# EAGLE design riffle-beta-0.1.5 (EAGLE 7.5.0)
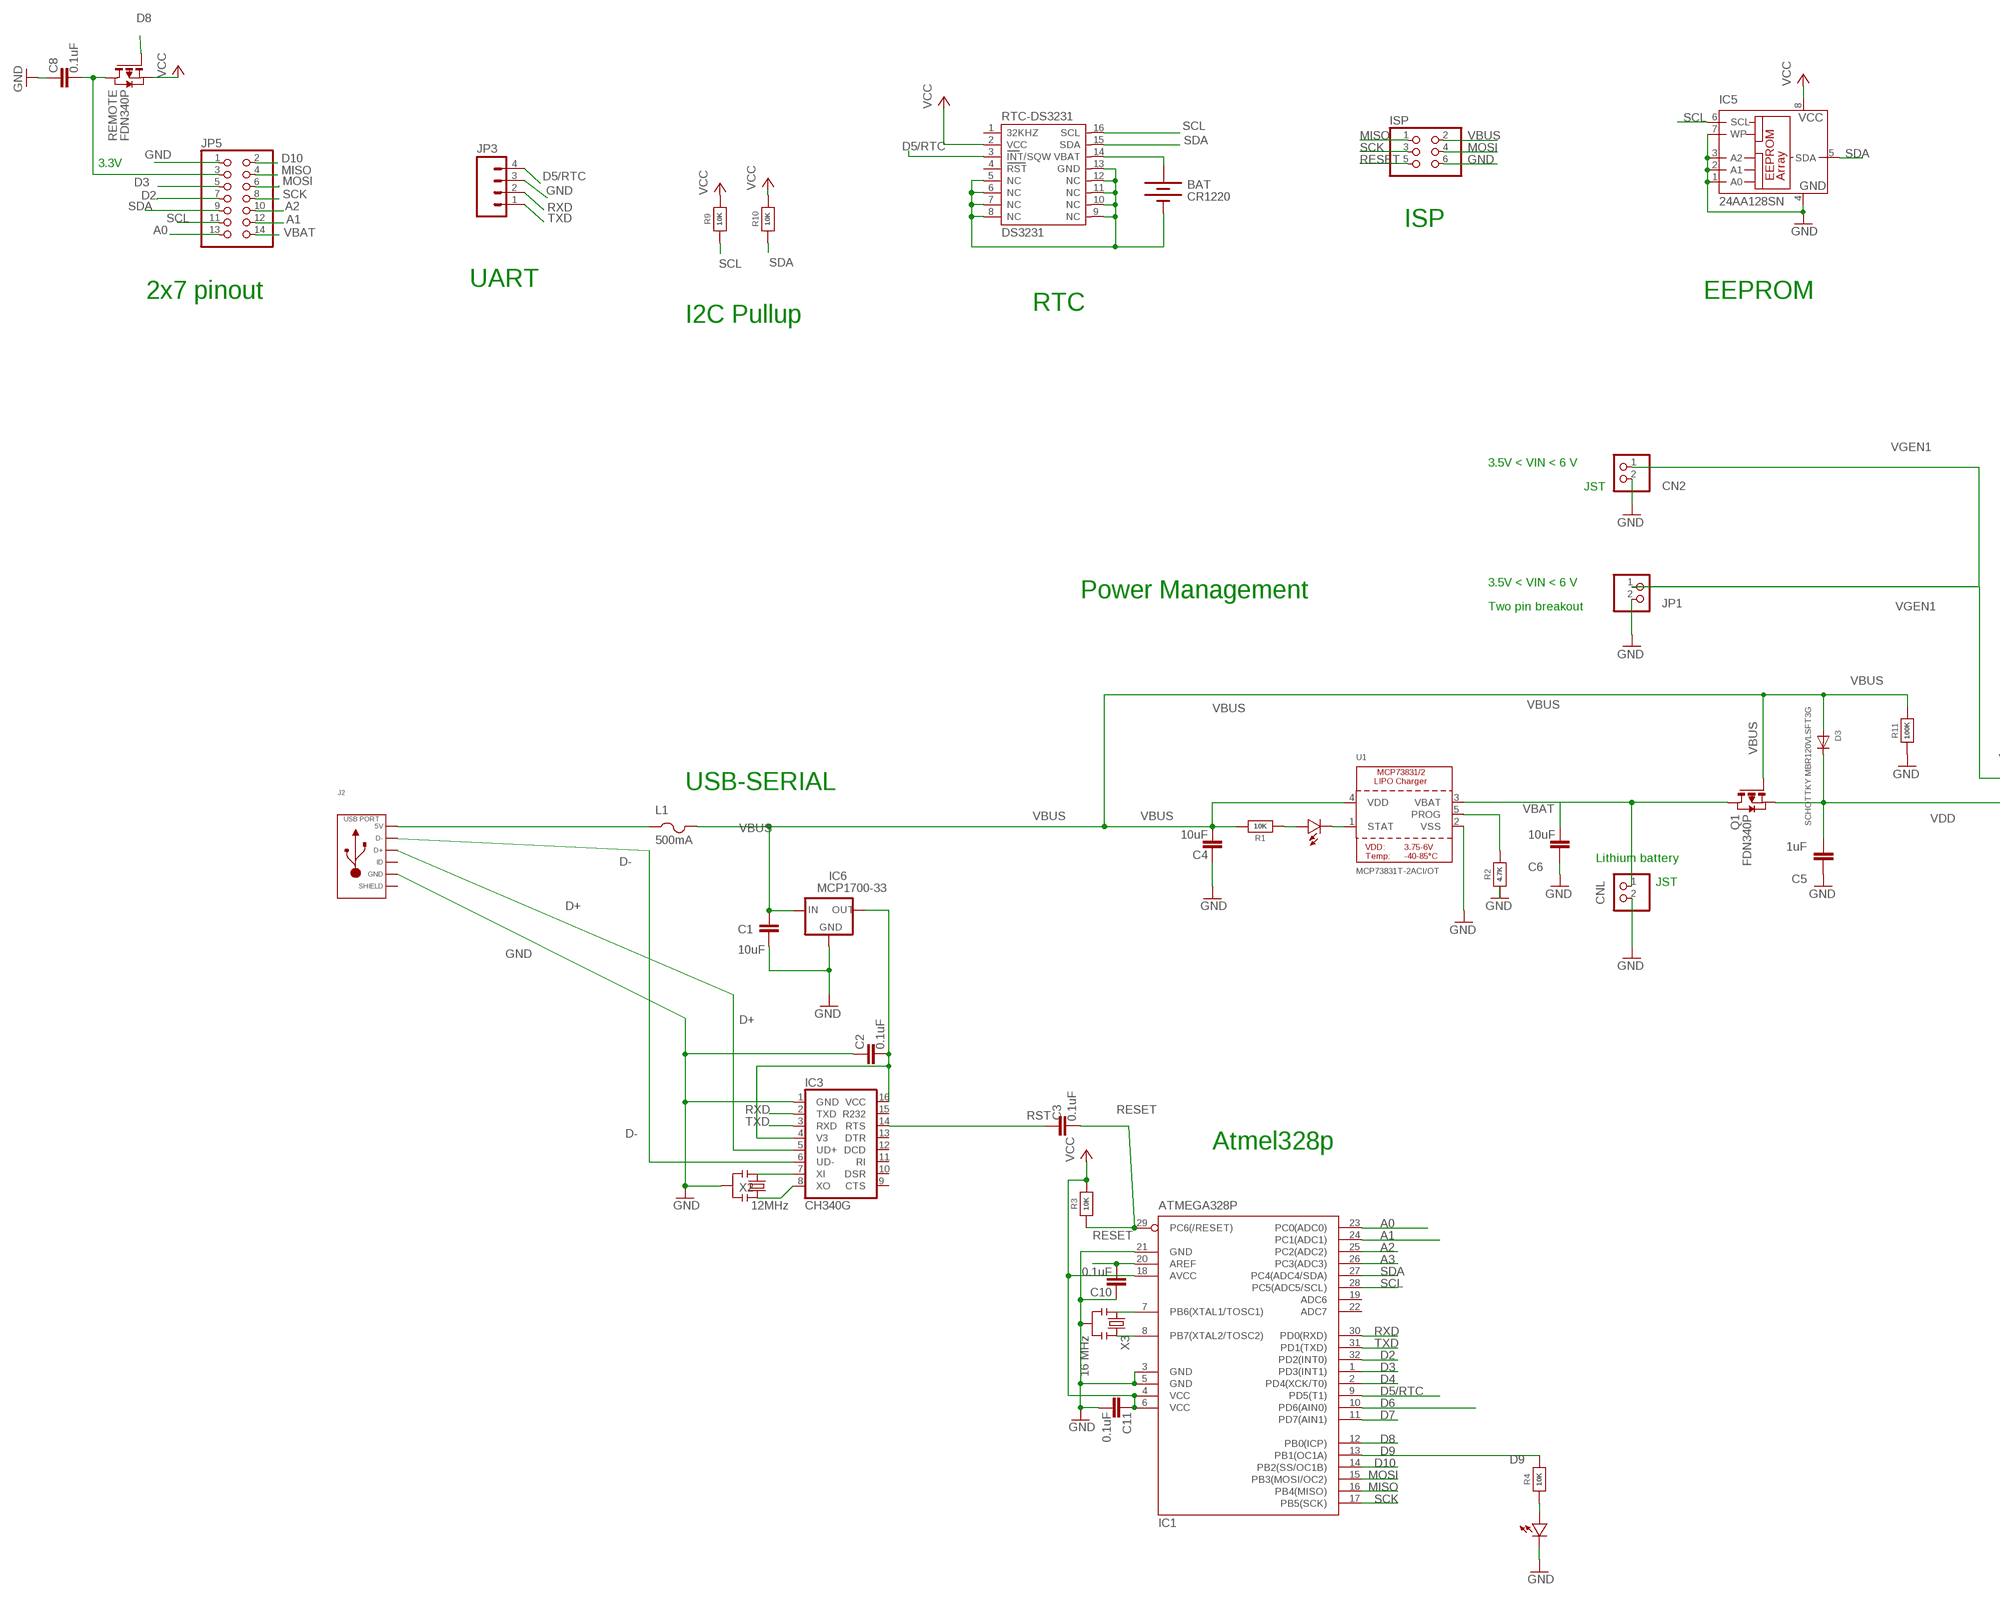
[diagram p0: schematic, sheet 1, part 1 of 2]
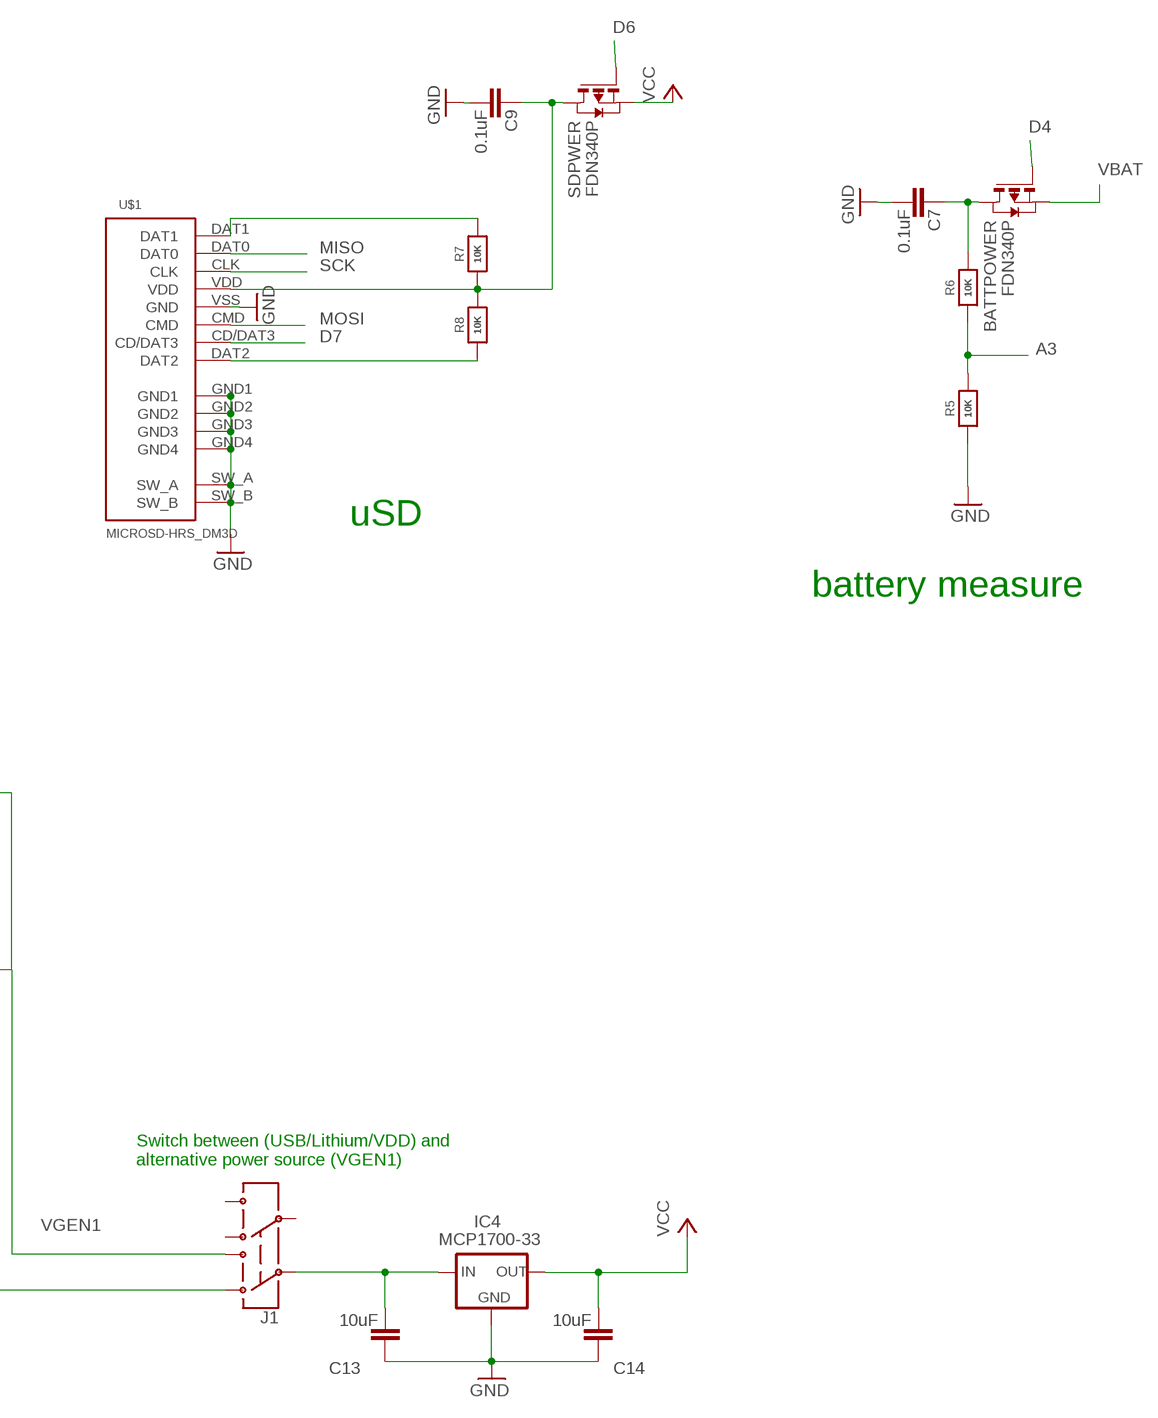
[diagram p1: schematic, sheet 1, part 2 of 2]

## Parts
BAT  CR1220  BATTERYBATTERY_12MM_SMT  [BATTCON_12MM_SMT]
BATTPOWER  FDN340P  PMOSSOT23  [SOT-23]
C1  10uF  CAP0603-CAP  [0603-CAP]
C2  0.1uF  CAP0603-CAP  [0603-CAP]
C3  0.1uF  CAP0603-CAP  [0603-CAP]
C4  10uF  CAP0603-CAP  [0603-CAP]
C5  1uF  CAP0603-CAP  [0603-CAP]
C6  10uF  CAP0603-CAP  [0603-CAP]
C7  0.1uF  CAP0603-CAP  [0603-CAP]
C8  0.1uF  CAP0603-CAP  [0603-CAP]
C9  0.1uF  CAP0603-CAP  [0603-CAP]
C10  0.1uF  CAP0603-CAP  [0603-CAP]
C11  0.1uF  CAP0603-CAP  [0603-CAP]
C13  10uF  CAP0603-CAP  [0603-CAP]
C14  10uF  CAP0603-CAP  [0603-CAP]
CN2  JST_2PIN-SMT-RA  [JST-PH-2-SMT-RA]
CNL  JST_2PIN-SMT-RA  [JST-PH-2-SMT-RA]
D1  LED0603  [0603-LED]
D2  LED0603  [0603-LED]
D3  SCHOTTKY MBR120VLSFT3G  DIODE_SOD-123FL  [SOD-123FL]
IC1  ATMEGA328P  MEGA8-AI  [TQFP32-08]
IC3  CH340G  [SO16]
IC4  MCP1700-33  MCP1700SOT89  [SOT89]
IC5  24AA128SN  [SO-08]
IC6  MCP1700-33  MCP1700SOT89  [SOT89]
ISP  PINHD-2X3  [2X03]
J1  AYZ0202  [AYZ0202]
J2  USB_MICRO_RIGHT  [MICROUSB-RIGHT]
JP1  PINHD-1X2  [1X02]
JP3  M04SMD  [1X04-SMD]
JP5  PINHD-2X7  [2X07]
L1  500mA  PTCFUSE-1206  [R1206]
Q1  FDN340P  PMOSSOT23  [SOT-23]
R1  10K  RESISTOR_0603_NOOUT  [0603-NO]
R2  4.7K  RESISTOR_0603_NOOUT  [0603-NO]
R3  10K  RESISTOR_0603_NOOUT  [0603-NO]
R4  10K  RESISTOR_0603_NOOUT  [0603-NO]
R5  10K  RESISTOR_0603_NOOUT  [0603-NO]
R6  10K  RESISTOR_0603_NOOUT  [0603-NO]
R7  10K  RESISTOR_0603_NOOUT  [0603-NO]
R8  10K  RESISTOR_0603_NOOUT  [0603-NO]
R9  10K  RESISTOR_0603_NOOUT  [0603-NO]
R10  10K  RESISTOR_0603_NOOUT  [0603-NO]
R11  100K  RESISTOR_0603_NOOUT  [0603-NO]
REMOTE  FDN340P  PMOSSOT23  [SOT-23]
RTC-DS3231  DS3231  [DS3231]
SDPWER  FDN340P  PMOSSOT23  [SOT-23]
U1  MCP73831T-2ACI/OT  MCP73831/2  [SOT23-5]
U$1  MICROSD-HRS_DM3D  [DM3D]
X2  12MHz  RESONATORSMD  [RESONATOR-SMD]
X3  16 MHz  RESONATORSMD  [RESONATOR-SMD]

## Nets
A0: IC1.23(PC0(ADC0)) JP5.13
A1: IC1.24(PC1(ADC1)) JP5.12
A2: IC1.25(PC2(ADC2)) JP5.10
A3: IC1.26(PC3(ADC3)) R5.2 R6.1
AREF: C10.1 IC1.20(AREF)
D2: IC1.32(PD2(INT0)) JP5.7
D3: IC1.1(PD3(INT1)) JP5.5
D4: BATTPOWER.3(G) IC1.2(PD4(XCK/T0))
D5/RTC: IC1.9(PD5(T1)) JP3.4 RTC-DS3231.3(INT/SQW)
D6: IC1.10(PD6(AIN0)) SDPWER.3(G)
D7: IC1.11(PD7(AIN1)) U$1.CD/DAT3
D8: IC1.12(PB0(ICP)) REMOTE.3(G)
D9: IC1.13(PB1(OC1A)) R4.2
D10: IC1.14(PB2(SS/OC1B)) JP5.2
D+: IC3.5(UD+) J2.3(D+)
D-: IC3.6(UD-) J2.2(D-)
GND: BAT.P$1(-) C1.1 C2.2 C4.2 C5.2 C6.2 C7.1 C8.2 C9.1 C10.2 C11.1 C13.2 C14.2 CN2.2 CNL.2 D2.MINUS IC1.3(GND) IC1.5(GND) IC1.21(GND) IC3.1(GND) IC4.1(GND) IC5.1(A0) IC5.2(A1) IC5.3(A2) IC5.4(GND) IC5.7(WP) IC6.1(GND) ISP.6 J2.5(GND) JP1.2 JP3.3 JP5.1 R2.1 R5.1 R11.1 RTC-DS3231.5(NC) RTC-DS3231.6(NC) RTC-DS3231.7(NC) RTC-DS3231.8(NC) RTC-DS3231.9(NC) RTC-DS3231.10(NC) RTC-DS3231.11(NC) RTC-DS3231.12(NC) RTC-DS3231.13(GND) U1.2(VSS) U$1.GND1 U$1.GND2 U$1.GND3 U$1.GND4 U$1.SW_A U$1.SW_B U$1.VSS(GND) X2.2 X3.2
MISO: IC1.16(PB4(MISO)) ISP.1 JP5.4 U$1.DAT0
MOSI: IC1.15(PB3(MOSI/OC2)) ISP.4 JP5.6 U$1.CMD
N$1: C13.1 IC4.2(IN) J1.2
N$2: IC1.7(PB6(XTAL1/TOSC1)) X3.1
N$3: IC1.8(PB7(XTAL2/TOSC2)) X3.3
N$4: C9.2 R7.1 R8.2 SDPWER.1(D) U$1.VDD
N$5: D1.MINUS U1.1(STAT)
N$6: R2.2 U1.5(PROG)
N$7: C8.1 JP5.3 REMOTE.1(D)
N$8: C2.1 IC3.4(V3) IC3.16(VCC) IC6.3(OUT)
N$9: J2.1(5V) L1.1
N$11: IC3.7(XI) X2.1
N$13: IC3.8(XO) X2.3
N$15: BATTPOWER.1(D) C7.2 R6.2
N$16: R7.2 U$1.DAT1
N$17: D2.PLUS R4.1
N$18: R8.1 U$1.DAT2
N$19: D1.PLUS R1.1
RESET: C3.1 IC1.29(PC6(/RESET)) ISP.5 R3.1
RST: C3.2 IC3.14(RTS)
RTC_BATT: BAT.P$2(+) RTC-DS3231.14(VBAT)
RXD: IC1.30(PD0(RXD)) IC3.2(TXD) JP3.2
SCK: IC1.17(PB5(SCK)) ISP.3 JP5.8 U$1.CLK
SCL: IC1.28(PC5(ADC5/SCL)) IC5.6(SCL) JP5.11 R9.1 RTC-DS3231.16(SCL)
SDA: IC1.27(PC4(ADC4/SDA)) IC5.5(SDA) JP5.9 R10.1 RTC-DS3231.15(SDA)
TXD: IC1.31(PD1(TXD)) IC3.3(RXD) JP3.1
VBAT [vcc]: BATTPOWER.2(S) C6.1 CNL.1 JP5.14 Q1.1(D) U1.3(VBAT)
VBUS [vcc]: C1.2 C4.1 D3.A IC6.2(IN) ISP.2 L1.2 Q1.3(G) R1.2 R11.2 U1.4(VDD)
VCC: C11.2 C14.1 IC1.4(VCC) IC1.6(VCC) IC1.18(AVCC) IC4.3(OUT) IC5.8(VCC) R3.2 R9.2 R10.2 REMOTE.2(S) RTC-DS3231.2(VCC) SDPWER.2(S)
VDD: C5.1 D3.C J1.3 Q1.2(S)
VGEN1: CN2.1 J1.1 JP1.1
Unconnected: IC1.19(ADC6) IC1.22(ADC7) IC3.9(CTS) IC3.10(DSR) IC3.11(RI) IC3.12(DCD) IC3.13(DTR) IC3.15(R232) J1.4 J1.5 J1.6 J2.4(ID) RTC-DS3231.1(32KHZ) RTC-DS3231.4(RST)

## Notes on the sheet
- 3.3V
- ISP
- UART | uSD
- 2x7 pinout | EEPROM
- RTC
- I2C Pullup
- battery measure
- 3.5V < VIN < 6 V
- JST
- 3.5V < VIN < 6 V
- Power Management
- Two pin breakout
- Switch between (USB/Lithium/VDD) and 
  alternative power source (VGEN1)
- USB-SERIAL
- Lithium battery
- JST
- Atmel328p

## Power pins joined to a net without a drawn wire
SLD: J2.S1(SLD) J2.S2(SLD) J2.S3(SLD) J2.S4(SLD) J2.S5(SLD) J2.S6(SLD) J2.S7(SLD) J2.S8(SLD)

## Library data of the parts
BAT = SparkFunNew:BATTERY: Battery Holders Various common sizes : AA, AAA, 20mm coin cell and 12mm coin cell.
BATTPOWER Q1 REMOTE SDPWER = zetex:PMOSSOT23: MOS FET; OC_FARNELL: unknown; OC_NEWARK: unknown
C1-C11 C13 C14 = SparkFun:CAP: Capacitor Standard 0603 ceramic capacitor, and 0.1" leaded capacitor.
CN2 CNL = adafruit:JST_2PIN: JST 2-Pin Connectors of various flavors SMT-RA (S2B-PH-SM4) 4UConnector #17311 SMT (B2B-PH-SM4) THM-RA (S2B-PH) THM (B2B-PH)
D1 D2 = LowPowerLab:LED
D3 = adafruit:DIODE: Diode SMADIODE - SMA Surface Mount Package 20V 1A Schottky Diode Digikey: 641-1014-6-ND DO-1N4148 - Through Hole Small Current Diode SOD-123 20V 1 A (.5mV Vf) Schottky Diode - Digikey: MBRX120TPMSCT-ND SOD-323 10V 570mA (.38mV Vf, 3ns) Schottky Diode - Digikey: ZLLS410CT-ND SOD-523 30V 30mA Schottky Diode (RB751S-40TE61) - Digikey: RB751S-40TE61CT-ND SOT23-R/W - SOT23 Package (R = Solder Paste/Reflow Ovens, W = Hand-Soldering) BAT54Film 40V 300mA - Digikey: 497-7162-1-ND
IC1 = atmel:MEGA8: MICROCONTROLLER 8 Kbytes FLASH, 1 kbytes SRAM, 512 bytes EEPROM, USART, 6-channel 10 bit ADC, 2-channel 8 bit ADC Pin compatible with Atmega48, ATMega88, ATMega168 Source: avr.lbr; MPN: ATMEGA8-16AU; OC_FARNELL: 9171371; OC_NEWARK: 73M8863
IC3 = SparkFunNew:CH340
IC4 IC6 = adafruit:MCP1700: VOLTAGE REGULATOR
IC5 = microchip:24*: Serial EEPROM I2C; MF: MICROCHIP; MPN: 24AA128-I/SN; OC_FARNELL: unknown; OC_NEWARK: 92C6842
ISP = pinhead:PINHD-2X3: PIN HEADER
J1 = SparkFunNew:AYZ0202: SPDT Slide Switch Simple SMD single-pull double-throw slide switch. Good for less than 350mA power switch, switching UARTs between devices, etc. Spark Fun Electronics SKU : COM-00597
J2 = MF_Connectors:USB: Library: MF_Connectors Description: 5 Pin USB Connectors. SLD is the shield connection. Usually tied to ground through a small ferrite bead.
JP1 = pinhead:PINHD-1X2: PIN HEADER
JP3 = SparkFun:M04: Header 4 Standard 4-pin 0.1" header. Use with straight break away headers (SKU : PRT-00116), right angle break away headers (PRT-00553), swiss pins (PRT-00743), machine pins (PRT-00117), and female headers (PRT-00115). Molex polarized connector foot print use with SKU : PRT-08231 with associated crimp pins and housings.
JP5 = pinhead:PINHD-2X7: PIN HEADER
L1 = adafruit:PTCFUSE: PTC fuses, resettable thermistors
R1-R11 = microbuilder:RESISTOR: Resistors For new designs, use the packages preceded by an '_' character since they are more reliable: The following footprints should be used on most boards: _0402 - Standard footprint for regular board layouts _0603 - Standard footprint for regular board layouts _0805 - Standard footprint for regular board layouts _1206 - Standard footprint for regular board layouts For extremely tight-pitch boards where space is at a premium, the following 'micro-pitch' footprints can be used (smaller pads, no silkscreen outline, etc.): _0402MP - Micro-pitch footprint for very dense/compact boards _0603MP - Micro-pitch footprint for very dense/compact boards _0805MP - Micro-pitch footprint for very dense/compact boards _1206MP - Micro-pitch footprint for very dense/compact boards
RTC-DS3231 = _lh-library:DS3231
U1 = microbuilder:MCP73831/2: MCP73831/2 LIPO Charger VDD: 3.75 - 6V Temp -40 - 85°C Programmable Charge Rate: 15-500mA NOTE: STAT is a tri-state logic output on the MCP73831 and an open-drain output on the MCP73832. SOT23-5 with 4.2V output and tri-state logic on STAT = MCP73831T-2ACI/OT
U$1 = hrs_DM3D-SF:MICROSD-HRS_DM3D
X2 = SparkFunNew:RESONATOR: Resonator Small SMD resonator. This is the itty bitty 10/20MHz resonators with built in caps. CSTCE10M0G55 and CSTCE20M0V53. Footprint has been reviewed closely but hasn't been tested yet.
X3 = SparkFun:RESONATOR: Resonator Small SMD resonator. This is the itty bitty 10/20MHz resonators with built in caps. CSTCE10M0G55 and CSTCE20M0V53. Footprint has been reviewed closely but hasn't been tested yet.

## Board
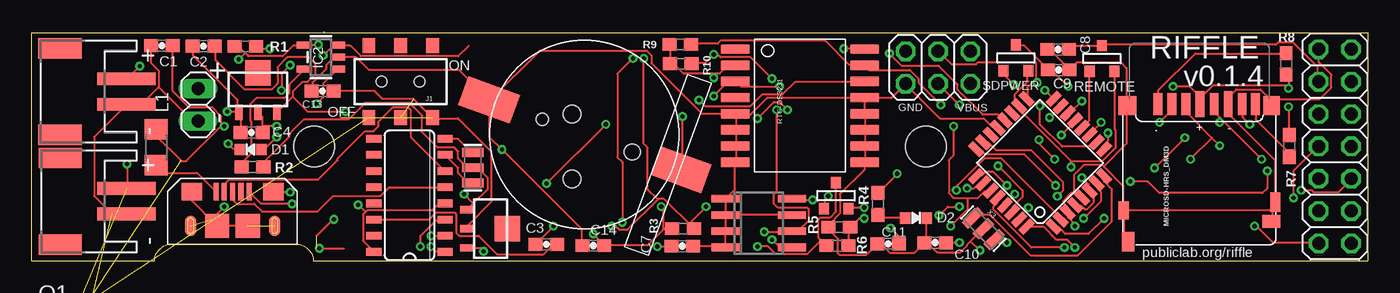
[diagram p2: board, top side]
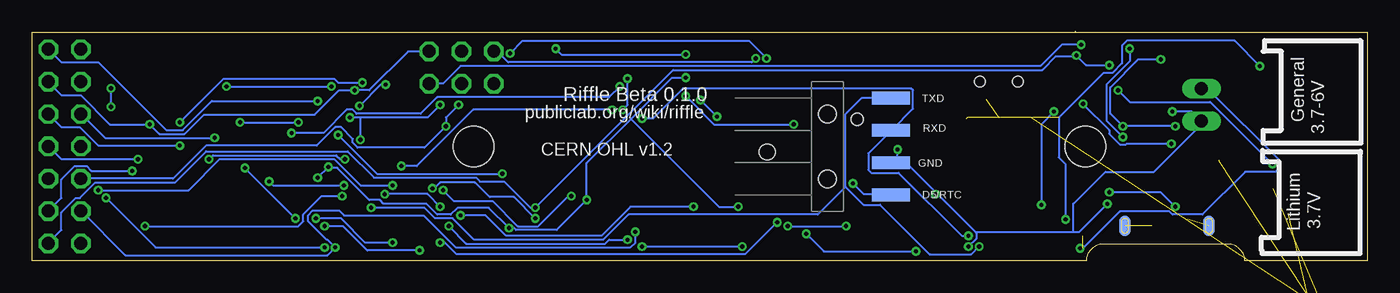
[diagram p3: board, bottom side, seen from below]

Size 104.8 x 18.01 mm. Coordinates in mm from the lower left corner, seen from the top.
Outline: 22.91,18.01 22.96,18.01
Outline: 0,0 0,17.96 104.8,17.96 104.8,0 22.07,0 arc90 20.75,1.32 10.95,1.32 arc90 9.63,0 0,0
Copper layers (1*16): Top 0.0356mm / dielectric 1.5011mm / Bottom 0.0356mm
Design rules "LaenPCBOrder": minimum track width 6mil, minimum drill 13mil, track to track 6mil, track to pad 6mil, pad to pad 6mil, via to via 6mil, smd to smd 6mil, copper to edge 15mil, drill to drill 6mil, minimum pad ring 7mil, minimum via ring 7mil, stop-mask expansion 3mil, vias tented up to drill 0mil, thermal gap 10mil
Holes 3.2 mm at 70.13,9 22.13,9

### Footprints (pad centres in the part's own frame; a part is rotated, then mirrored left to right if it is on the bottom)
BATTCON_12MM_SMT = smd 2.4 x 4.3: P$1 0,11.96 | smd 2.4 x 4.2: P$2 0,-4.1 | hole 0.95: 0,7.5 | hole 1.25: 0,0
SOT-23 = smd 0.787 x 0.889: 1 0.025,-1.016; 2 -0.94,1.016; 3 0.991,1.016
0603-CAP = smd 1.1 x 1: 1 -0.85,0; 2 0.85,0
JST-PH-2-SMT-RA = smd 1 x 4.6: 1 1,-3.7; 2 -1,-3.7 | smd 1.6 x 3.4: NC1 -3.4,1.5; NC2 3.4,1.5
0603-LED = smd 0.8 x 0.9: MINUS -0.85,0; PLUS 0.85,0
SOD-123FL = smd 0.91 x 1.22: A 1.637,0; C -1.637,0
TQFP32-08 = smd 1.27 x 0.559: 1 -4.293,2.8; 2 -4.293,2; 3 -4.293,1.2; 4 -4.293,0.4; 5 -4.293,-0.4; 6 -4.293,-1.2; 7 -4.293,-2; 8 -4.293,-2.8; 17 4.293,-2.8; 18 4.293,-2; 19 4.293,-1.2; 20 4.293,-0.4; 21 4.293,0.4; 22 4.293,1.2; 23 4.293,2; 24 4.293,2.8 | smd 0.559 x 1.27: 9 -2.8,-4.293; 10 -2,-4.293; 11 -1.2,-4.293; 12 -0.4,-4.293; 13 0.4,-4.293; 14 1.2,-4.293; 15 2,-4.293; 16 2.8,-4.293; 25 2.8,4.293; 26 2,4.293; 27 1.2,4.293; 28 0.4,4.293; 29 -0.4,4.293; 30 -1.2,4.293; 31 -2,4.293; 32 -2.8,4.293
SO16 = smd 0.6 x 1.2: 1 -4.445,-2.8; 2 -3.175,-2.8; 3 -1.905,-2.8; 4 -0.635,-2.8; 5 0.635,-2.8; 6 1.905,-2.8; 7 3.175,-2.8; 8 4.445,-2.8; 9 4.445,2.8; 10 3.175,2.8; 11 1.905,2.8; 12 0.635,2.8; 13 -0.635,2.8; 14 -1.905,2.8; 15 -3.175,2.8; 16 -4.445,2.8
SOT89 = smd 0.58 x 1.2: 1 -1.5,-1.8; 2 0,-1.8; 3 1.5,-1.8 | smd 2 x 2: 4 0,1.3
SO-08 = smd 0.6 x 2.2: 1 -1.905,-2.6; 2 -0.635,-2.6; 3 0.635,-2.6; 4 1.905,-2.6; 5 1.905,2.6; 6 0.635,2.6; 7 -0.635,2.6; 8 -1.905,2.6
2X03 = drill 1.016 octagon: 1 -2.54,-1.27; 2 -2.54,1.27; 3 0,-1.27; 4 0,1.27; 5 2.54,-1.27; 6 2.54,1.27
AYZ0202 = smd 1 x 1.15: 1 -2.5,2.825; 2 0,2.825; 3 2.5,2.825; 4 -2.5,-2.825; 5 0,-2.825; 6 2.5,-2.825 | hole 0.85: 1.5,0; -1.5,0
MICROUSB-RIGHT = smd 0.4 x 1.35: 1 -1.3,1.27; 2 -0.65,1.27; 3 0,1.27; 4 0.65,1.27; 5 1.3,1.27 | smd 0.9 x 1.6: S1 -3.3,-1.4; S2 3.3,-1.4 | smd 1.6 x 1.4: S3 -3.2,1.27; S4 3.2,1.27 | smd 1.9 x 1.9: S5 -1.2,-1.405; S6 1.2,-1.405 | smd 0.9 x 1.6 bottom: S7 -3.3,-1.4; S8 3.3,-1.4
1X02 = drill 1.016 long: 1 -1.27,0; 2 1.27,0
1X04-SMD = smd 1 x 3: 1 -3.81,5; 2 -1.27,5; 3 1.27,5; 4 3.81,5 | hole 1.4: -2.54,0; 2.54,0
2X07 = drill 1.016 octagon: 1 -7.62,-1.27; 2 -7.62,1.27; 3 -5.08,-1.27; 4 -5.08,1.27; 5 -2.54,-1.27; 6 -2.54,1.27; 7 0,-1.27; 8 0,1.27; 9 2.54,-1.27; 10 2.54,1.27; 11 5.08,-1.27; 12 5.08,1.27; 13 7.62,-1.27; 14 7.62,1.27
R1206 = smd 1.6 x 1.803: 1 -1.422,0; 2 1.422,0
0603-NO = smd 1.1 x 1: 1 -0.85,0; 2 0.85,0
DS3231 = smd 0.762 x 2.286: 1 -4.445,-5.08; 2 -3.175,-5.08; 3 -1.905,-5.08; 4 -0.635,-5.08; 5 0.635,-5.08; 6 1.905,-5.08; 7 3.175,-5.08; 8 4.445,-5.08; 9 4.445,5.08; 10 3.175,5.08; 11 1.905,5.08; 12 0.635,5.08; 13 -0.635,5.08; 14 -1.905,5.08; 15 -3.175,5.08; 16 -4.445,5.08
SOT23-5 = smd 0.55 x 1.2: 1 -0.95,-1.3; 2 0,-1.3; 3 0.95,-1.3; 4 0.95,1.3; 5 -0.95,1.3
DM3D = smd 0.7 x 1.75: CD/DAT3 8.15,0.45; CLK 4.85,0.45; CMD 7.05,0.45; DAT0 2.65,0.45; DAT1 1.6,0.45; DAT2 9.25,0.45 | smd 0.8 x 1.5: GND1 0.05,8.15 | smd 0.8 x 1.4: GND2 11.95,8.8 | smd 1.4 x 1.5: GND3 11.65,0.55 | smd 1.3 x 1.5: GND4 0.35,0.55 | smd 1 x 1.55: SW_A 11.6,11.25 | smd 1.4 x 1: SW_B 0.35,9.65 | smd 0.7 x 2.032: VDD 5.95,0.45; VSS 3.75,0.45
RESONATOR-SMD = smd 0.7 x 1.7: 1 -1.2,0; 2 0,0; 3 1.2,0

### Placement (x,y rotation side)
BAT  47.1,8.57 70 top
BATTPOWER  63.12,5.14 180 top
C1  10.2,16.92 0 top
C2  13.48,16.89 180 top
C3  40.37,1.31 0 top
C4  17.24,10.1 180 top
C5  1.52,-12.67 0 top  (outside the outline)
C6  1.52,-15.65 0 top  (outside the outline)
C7  51.03,1.17 180 top
C8  80.53,16.62 180 top
C9  80.57,15.01 180 top
C10  70.86,1.44 180 top
C11  67.19,1.36 0 top
C13  22.81,13.36 180 top
C14  44.04,1.22 180 top
CN2  3.71,13.31 90 top
CNL  3.72,4.7 90 top
D1  17.15,8.76 0 top
D2  69.37,3.38 180 top
D3  SCHOTTKY SM4002PL-TP  [SOD-123FL]  2.18,-9.58 0 top  (outside the outline)
IC1  79.09,7.72 135 top
IC3  29.63,5.17 90 top
IC4  35.99,2.54 270 top
IC5  57.02,2.98 270 top
IC6  17.73,13.49 0 top
ISP  71.1,15.2 180 top
J1  28.93,14.1 180 top
J2  15.75,4.17 0 top
JP1  13.04,12.26 270 top
JP3  42.39,9 270 bottom
JP5  102.23,9.01 270 top
L1  9.75,8.94 90 top
Q1  1.91,-6.48 0 top  (outside the outline)
R1  16.75,16.87 180 top
R2  17.32,7.39 180 top
R3  51.09,2.55 180 top
R4  66.37,4.5 90 top
R5  63.35,2.66 0 top
R6  63.2,1.22 180 top
R7  98.65,9.05 270 top
R8  98.4,15.49 270 top
R9  50.91,15.5 180 top
R10  50.88,17.03 180 top
R11  1.5,-18.34 0 top  (outside the outline)
REMOTE  83.98,15.91 180 top
RTC-DS3231  60.27,12.21 270 top
SDPWER  77.23,15.95 180 top
U1  22.68,16.03 90 top
U$1  97.6,12.78 180 top
X2  34.59,7.33 90 top
X3  74.66,2.55 135 top

### Tracks (layer width: path | path; a pad name or v marks a point on that pad's centre or on a via)
A0  (via drill 0.33)
  Top 0.152: v80.47,5.11 80.92,5.56 80.92,6.17 78.41,8.69 75.67,8.69 75.06,9.3 74.68,9.3 IC1.23 | v95.94,2.74 96.09,2.74 97.38,1.45 100.89,1.45 JP5.13
  Bottom 0.152: v80.47,5.11 82.07,5.11 83.52,3.66 83.52,3.12 83.9,2.74 v95.94,2.74
A1  (via drill 0.33)
  Top 0.152: v80.31,5.94 77.88,8.38 74.83,8.38 74.45,8.76 74.14,8.76 IC1.24 | v86.18,6.25 87.55,6.25 88.47,5.33 96.55,5.33 96.93,5.71 v96.93,7.09
  Bottom 0.152: v80.31,5.94 85.88,5.94 v86.18,6.25 | v96.93,7.09 100.13,7.09 100.51,7.47 101.42,7.47 102.49,6.4 102.49,4.95 103.48,3.96 JP5.12
A2  (via drill 0.33)
  Top 0.152: v76.5,5.94 75.44,7.01 74.83,7.01 74.52,6.71 74.14,6.71 IC1.25 | v99.59,5.56 100.43,5.56 100.58,5.41 102.49,5.41 103.48,6.4 JP5.10
  Bottom 0.152: v76.5,5.94 79.02,5.94 81.08,8 90.07,8 92.51,5.56 v99.59,5.56
A3  (via drill 0.33)
  Top 0.152: R6.1 64.08,1.22 64.08,2.52 64.16,2.59 R5.2 64.24,2.67 64.92,3.35 v65.3,3.35 | v73.38,5.71 73.91,5.71 74.29,6.1 74.6,6.1 IC1.26
  Bottom 0.152: v73.38,5.71 73.23,5.71 72.77,6.17 70.03,6.17 68.88,5.03 66.98,5.03 v65.3,3.35
AREF  (via drill 0.33)
  Top 0.152: v72.77,1.45 71.78,1.45 C10.1 | v46.33,3.05 46.33,7.77 45.95,8.15 45.95,14.71 v47.17,15.93 | v67.28,16.31 68.28,15.32 71.17,15.32 72.62,13.87 72.62,13.49 74.6,11.51 75.82,11.51 76.28,11.05 IC1.20
  Bottom 0.152: v72.77,1.45 72.39,1.45 71.48,0.53 48.84,0.53 v46.33,3.05 | v47.17,15.93 48.54,17.3 66.29,17.3 v67.28,16.31
D2  (via drill 0.33)
  Top 0.152: v81.84,1.07 81.23,1.68 80.39,1.68 79.4,2.67 78.1,2.67 IC1.32 | v98.98,4.95 98.98,7.09 100.89,8.99 JP5.7
  Bottom 0.152: v81.84,1.07 95.1,1.07 v98.98,4.95
D3  (via drill 0.33)
  Top 0.152: v84.12,3.35 82.91,2.13 81.08,2.13 80.54,2.67 80.16,2.67 IC1.1 | v90.45,9.68 v88.09,7.32
  Bottom 0.152: v88.09,7.32 v84.12,3.35 | v90.45,9.68 99.06,9.68 100.89,11.51 JP5.5
D4  (via drill 0.33)
  Top 0.152: v62.48,5.11 62.18,4.8 62.18,4.19 BATTPOWER.3 | v72.54,5.56 72.54,5.87 74.75,8.08 76.05,8.08 80.7,3.43 80.7,3.28 IC1.2
  Bottom 0.152: v62.48,5.11 62.71,5.11 65.07,2.74 66.67,2.74 68.66,4.72 71.7,4.72 v72.54,5.56
D5/RTC  (via drill 0.33)
  Top 0.152: v84.43,10.06 84.43,9.45 84.12,9.14 84.12,8.84 IC1.9 | v58.67,13.72 55.63,13.72 55.24,14.1 RTC-DS3231.3 55.17,14.1 54.64,14.1 v53.49,12.95 | v45.03,10.74 v40.39,6.1
  Bottom 0.152: v84.43,10.06 81.91,10.06 80.09,11.89 79.63,11.89 79.32,11.58 74.29,11.58 73,12.88 59.51,12.88 v58.67,13.72 | v40.39,6.1 39.55,5.26 37.41,5.26 JP3.4 | v45.03,10.74 51.28,10.74 v53.49,12.95
D6  (via drill 0.33)
  Top 0.152: v77.04,13.87 76.28,14.63 76.28,14.94 SDPWER.3 | v79.1,12.19 79.1,10.74 80.85,8.99 83.21,8.99 83.52,9.3 IC1.10
  Bottom 0.152: v77.04,13.87 77.42,13.87 v79.1,12.19
D7  (via drill 0.33)
  Top 0.152: v83.9,10.9 82.98,9.98 IC1.11 | v88.47,10.9 89.38,11.81 89.38,12.27 U$1.CD/DAT3
  Bottom 0.152: v88.47,10.9 v83.9,10.9
D8
  Top 0.152: REMOTE.3 82.98,14.86 82.98,11.05 82.45,10.52 IC1.12
D9  (via drill 0.33)
  Top 0.152: v67.89,6.86 66.45,5.41 R4.2 | v80.77,9.91 81.84,10.97 IC1.13
  Bottom 0.152: v67.89,6.86 77.72,6.86 v80.77,9.91
D10  (via drill 0.33)
  Top 0.152: v82.37,12.57 81.46,11.66 81.31,11.66 IC1.14
  Bottom 0.152: v82.37,12.57 90.68,12.57 92.96,10.29 94.26,10.29 99.59,15.62 102.49,15.62 103.48,16.61 JP5.2
D+
  Top 0.152: IC3.5 32.38,5.79 28.04,5.79 27.36,5.11 23.62,5.11 22.4,3.89 18.06,3.89 17.45,4.5 16.08,4.5 15.77,4.8 15.77,5.41 J2.3
D-
  Top 0.152: IC3.6 32.38,7.09 29.72,9.75 29.72,11.89 29.49,12.12 28.35,12.12 27.2,10.97 27.2,10.59 26.82,10.21 26.14,10.21 24,8.08 24,7.92 22.48,6.4 15.47,6.4 15.16,6.1 15.16,5.49 J2.2
GND  (via drill 0.33)  (3 unrouted)
  Top 0.152: 81.76,5.33 82.07,5.33 82.37,5.03 IC1.5 | 81.76,5.33 81.53,5.33 80.92,4.72 80.92,4.57 81.23,4.27 81.23,3.89 IC1.3 81.31,3.81 81.31,3.43 81.84,2.9 v81.84,2.74 | U$1.GND2 85.72,3.96 85.72,1.83 85.95,1.6 U$1.SW_A | 81.76,5.33 81.76,6.78 82.52,7.54 83.97,7.54 84.09,7.43 | 84.09,7.43 85.65,5.87 85.65,4.04 U$1.GND2 | C8.2 79.71,16.61 79.86,16.61 81.38,15.09 C9.1 81.46,15.09 81.99,15.62 85.42,15.62 85.88,15.16 85.88,12.27 U$1.GND3 85.88,12.19 85.88,9.22 84.09,7.43 | 97.31,3.96 97.31,4.34 97.54,4.57 U$1.GND1 | 97.31,3.96 97.31,3.2 U$1.SW_B | U$1.GND1 97.54,4.65 97.54,7.92 93.88,11.58 93.88,12.27 U$1.VSS 93.88,12.34 93.88,12.88 94.49,13.49 96.39,13.49 97.23,12.65 97.23,12.27 U$1.GND4 97.23,12.72 101.04,12.72 101.96,13.64 101.96,14.63 100.96,15.62 100.96,16.61 JP5.1 | 97.31,3.96 85.8,3.96 U$1.GND2 | 97.31,3.96 U$1.GND1 | RTC-DS3231.5 55.24,11.51 55.24,10.36 RTC-DS3231.6 55.24,10.29 55.24,9.07 RTC-DS3231.7 55.24,8.99 55.24,7.77 RTC-DS3231.8 55.17,7.7 55.17,5.64 54.48,4.95 IC5.1 54.41,4.88 54.41,3.66 IC5.2 | C7.1 51.89,1.14 54.41,1.14 IC5.4 | 54.41,1.07 IC5.4 | IC5.4 54.41,1.22 54.41,2.29 IC5.3 54.41,2.36 54.41,3.58 IC5.2 | IC5.7 59.59,3.66 54.48,3.66 IC5.2 | D2.MINUS 70.18,3.35 70.18,1.6 70.03,1.45 C10.2 | C10.2 69.95,1.37 69.19,0.61 67.36,0.61 66.67,1.29 66.37,1.29 C11.1 66.29,1.29 65.46,0.46 63.4,0.46 63.25,0.61 63.25,1.75 62.56,2.44 62.56,2.59 R5.1 62.56,2.67 62.56,2.9 63.4,3.73 63.4,5.26 65.3,7.16 65.3,7.7 RTC-DS3231.9 65.38,7.77 65.38,8.99 RTC-DS3231.10 65.38,9.07 65.38,10.29 RTC-DS3231.11 65.38,10.36 65.38,11.51 RTC-DS3231.12 65.38,11.58 65.38,12.8 RTC-DS3231.13
  Top 0.152: 73.65,1.56 73.38,1.29 73.38,1.22 72.85,0.69 71.02,0.69 70.18,1.52 C10.2 | 73.65,1.56 74.6,2.52 X3.2 | 75.74,10.52 IC1.21 75.67,10.52 75.36,10.52 74.68,11.2 71.25,11.2 68.58,13.87 ISP.6 68.5,13.87 67.44,12.8 65.46,12.8 RTC-DS3231.13 | RTC-DS3231.5 55.32,11.51 56.39,11.51 57.68,12.8 65.3,12.8 RTC-DS3231.13 | C13.2 22.02,13.41 22.02,14.02 23.09,15.09 23.09,15.39 23.7,16 23.93,16 U1.2 24,16 25.45,16 26.44,15.01 33.53,15.01 35.81,12.72 BAT.P$1 | C14.2 43.13,1.22 43.13,2.52 v36.88,8.76 35.89,9.75 35.89,12.65 BAT.P$1 | C4.2 16.38,10.13 16.38,11.51 16.23,11.66 IC6.1 | C2.2 12.65,16.84 12.65,16.15 16.15,12.65 16.15,11.73 IC6.1 | 9.94,13.68 8.61,12.34 7.47,12.34 CN2.2 7.39,12.27 4.88,9.75 4.88,5.11 6.25,3.73 7.39,3.73 CNL.2 | 9.94,13.68 9.98,13.72 9.98,14.94 9.37,15.54 9.37,16.92 C1.1 | 9.94,13.68 12.57,11.05 13.03,11.05 JP1.2 | v15.32,11.73 16.08,11.73 IC6.1 | R2.1 18.21,7.39 18.21,7.77 20.19,9.75 20.19,9.98 21.34,11.12 24.84,11.12 26.14,12.42 29.64,12.42 30.63,11.43 30.63,10.13 31.85,8.91 33.15,8.91 33.45,8.61 33.45,8.08 34.14,7.39 34.52,7.39 X2.2 34.59,7.32 34.98,7.32 35.74,6.55 35.74,5.64 34.63,4.53 | 34.63,4.53 34.21,4.12 IC4.1 | 32.46,0.76 IC3.1 32.38,0.76 31.7,0.76 v31.32,1.14 | v20.42,4.5 17.98,4.5 17.07,5.41 J2.5 | v33.91,5.26 34.63,4.53 | RTC-DS3231.5 55.17,11.58 52.58,11.58 48.62,15.54 48.62,16.15 48.23,16.54 39.85,16.54 35.97,12.65 BAT.P$1 | 73.65,1.56 v74.37,0.84
  Bottom 0.152: v15.32,11.73 13.79,11.73 13.11,11.05 JP1.2 13.11,10.97 13.11,10.67 16.76,7.01 20.57,7.01 23.09,4.5 23.09,2.29 | v31.32,1.14 30.71,1.75 30.71,2.21 30.75,2.25 | 33.79,5.3 36.19,7.7 36.88,7.7 | 33.79,5.3 30.75,2.25 | 36.88,7.7 37.34,7.7 JP3.3 36.88,7.7 | v20.42,4.5 22.63,2.29 23.09,2.29 | 23.09,2.29 30.71,2.29 30.75,2.25 | v33.91,5.26 33.83,5.26 33.79,5.3 | 36.88,7.7 v36.88,8.76 | v81.84,2.74 80.39,2.74 78.49,0.84 v74.37,0.84
MISO  (via drill 0.33)
  Top 0.152: v79.48,13.41 80.09,12.8 IC1.16 | v95.55,10.74 95.02,11.28 95.02,12.27 U$1.DAT0
  Bottom 0.152: ISP.1 73.69,16.46 75.29,16.46 78.33,13.41 v79.48,13.41 80.7,13.41 82.6,11.51 91.29,11.51 92.81,9.98 94.79,9.98 v95.55,10.74 98.68,10.74 100.96,13.03 102.49,13.03 103.48,14.02 JP5.4
MOSI  (via drill 0.33)
  Top 0.152: v79.86,11.28 80.7,12.12 IC1.15 | v72.77,12.27 71.17,13.87 ISP.4 | v93.19,9.07 92.58,9.68 | 92.58,9.68 90.6,11.66 90.6,12.27 U$1.CMD | v79.02,9.53 79.02,9.22 v80.24,8 | 92.58,9.68 v90.91,8
  Bottom 0.152: 79.02,11.28 73.76,11.28 v72.77,12.27 | 79.02,11.28 v79.86,11.28 | v93.19,9.07 99.59,9.07 101.04,10.52 102.49,10.52 103.48,11.51 JP5.6 | v79.02,9.53 79.02,11.28 | v80.24,8 80.62,8 80.92,8.31 90.6,8.31 v90.91,8
N$1  (2 unrouted)
  Top 0.152: 31.39,11.28 29.95,12.72 27.51,12.72 26.9,13.34 23.7,13.34 C13.1 | 31.47,11.2 33.45,11.2 36.04,8.61 36.04,4.65 34.21,2.82 34.21,2.59 IC4.2
N$2  (via drill 0.33)
  Top 0.152: v82.52,3.35 83.9,4.72 83.9,5.41 83.59,5.71 83.59,6.1 IC1.7 | v76.5,1.45 75.74,1.45 75.51,1.68 X3.1
  Bottom 0.152: v82.52,3.35 80.54,3.35 78.64,1.45 v76.5,1.45
N$3
  Top 0.152: IC1.8 84.12,6.63 84.12,6.25 84.73,5.64 84.73,3.12 82.07,0.46 78.33,0.46 75.13,3.66 74.07,3.66 73.84,3.43 X3.3
N$4  (via drill 0.33)
  Top 0.152: SDPWER.1 77.27,16.92 77.88,16.92 79.71,15.09 C9.2 79.78,15.01 80.01,15.01 v81.31,13.72 | v98.6,12.12 98.6,9.91 R7.1 | 98.6,13.79 98.6,14.48 98.45,14.63 R8.2 | 98.6,13.79 92.66,13.79 91.67,12.8 91.67,12.34 U$1.VDD 91.67,12.88 90.83,13.72 v89.53,13.72 | 98.6,13.79 v98.6,13.56
  Bottom 0.152: v98.6,13.56 v98.6,12.12 | v89.53,13.72 v81.31,13.72
N$5  (via drill 0.33)
  Top 0.152: v15.39,9.22 15.77,8.84 16.23,8.84 D1.MINUS | v22.33,12.34 22.86,12.88 22.86,13.95 23.93,15.01 U1.1
  Bottom 0.152: v15.39,9.22 18.9,9.22 18.97,9.14 19.43,9.14 20.27,9.98 20.27,10.29 v22.33,12.34
N$6
  Top 0.152: R2.2 16.54,7.39 16.54,7.77 17.22,8.46 17.22,10.97 17.14,11.05 17.14,12.34 17.6,12.8 19.81,12.8 20.19,13.18 20.19,13.87 21.34,15.01 U1.5
N$7
  Top 0.152: C8.1 81.38,16.69 81.61,16.92 83.9,16.92 REMOTE.1 83.97,16.99 97.61,16.99 97.76,17.14 98.98,17.14 100.89,15.24 100.89,14.1 JP5.3
N$8  (via drill 0.33)
  Top 0.152: 26.17,3.85 26.29,3.96 31.39,3.96 31.93,4.5 32.38,4.5 IC3.4 | 26.17,3.85 25.98,3.66 25.98,1.6 26.82,0.76 IC3.16 | 20.46,12.92 19.28,11.73 IC6.3 | 20.46,12.92 20.5,12.95 20.5,13.34 21.26,14.1 21.64,14.1 22.25,14.71 22.25,15.47 21.72,16 20.04,16 19.28,15.24 19.28,13.95 18.82,13.49 16.69,13.49 14.4,15.77 14.4,16.84 C2.1 | v25.6,4.42 26.17,3.85 | v24.61,11.73 21.64,11.73 20.46,12.92
  Bottom 0.152: v25.6,4.42 25.6,10.74 v24.61,11.73
N$9
  Top 0.152: J2.1 14.4,5.49 12.95,6.93 10.29,6.93 9.75,7.47 L1.1
N$11
  Top 0.152: IC3.7 32.46,8.31 33.45,7.32 33.45,6.93 34.21,6.17 34.52,6.17 X2.1
N$13
  Top 0.152: IC3.8 32.46,9.6 33.45,9.6 34.52,8.53 X2.3
N$15  (via drill 0.33)
  Top 0.152: BATTPOWER.1 63.09,6.1 63.09,3.89 62.64,3.43 61.87,3.43 61.72,3.28 61.72,1.83 62.33,1.22 R6.2 61.87,1.6 60.81,0.53 58.37,0.53 57.76,1.14 v56.92,1.14 | v49.07,1.14 50.14,1.14 C7.2
  Bottom 0.152: v56.92,1.14 v49.07,1.14
N$16
  Top 0.152: R7.2 98.6,8.23 98.6,8.53 96.01,11.12 96.01,12.27 U$1.DAT1
N$17
  Top 0.152: D2.PLUS 68.5,3.43 66.6,3.43 66.45,3.58 R4.1
N$18
  Top 0.152: R8.1 98.37,16.31 91.29,16.31 88.39,13.41 88.39,12.34 U$1.DAT2
N$19  (via drill 0.33)
  Top 0.152: v19.2,9.75 18.29,8.84 18.06,8.84 D1.PLUS | v18.67,16.69 17.75,16.69 17.6,16.84 R1.1
  Bottom 0.152: v19.2,9.75 20.5,11.05 20.5,13.87 18.67,15.7 v18.67,16.69
RESET  (via drill 0.33)
  Top 0.152: v40.92,2.74 39.55,1.37 C3.1 | v45.49,2.74 45.8,2.74 46.1,2.44 46.71,2.44 49.11,4.84 | 49.11,4.84 49.15,4.88 49.61,4.88 51.89,2.59 R3.1 51.59,2.97 v52.88,4.27 | v77.11,5.26 77.11,5.18 76.35,4.42 IC1.29 | v72.77,4.27 71.86,4.27 v71.17,3.58 | v48.01,15.93 48.01,9.22 48.31,8.91 48.31,5.64 49.11,4.84
  Bottom 0.152: v45.49,2.74 v40.92,2.74 | v77.11,5.26 73.76,5.26 v72.77,4.27 | v71.17,3.58 69.19,3.58 67.59,1.98 60.12,1.98 57.84,4.27 v52.88,4.27 | v48.01,15.93 48.31,15.62 67.44,15.62 68.28,16.46 68.5,16.46 ISP.5
RST
  Top 0.152: C3.2 41.15,1.29 40.92,1.29 40.16,0.53 36.5,0.53 35.05,1.98 33.53,1.98 33.3,2.21 33.3,3.66 33.15,3.81 31.7,3.81 31.17,3.28 26.9,3.28 IC3.14
RTC_BATT  (via drill 0.33)
  Top 0.152: v52.35,12.65 52.81,12.19 56.39,12.19 57.3,13.11 58.9,13.11 59.89,14.1 65.3,14.1 RTC-DS3231.14 | v51.05,11.35 51.05,7.32 50.98,7.24 BAT.P$2
  Bottom 0.152: v51.05,11.35 v52.35,12.65
RXD  (via drill 0.33)
  Top 0.152: v31.32,1.98 32.38,1.98 IC3.2 | v75.82,7.47 77.72,5.56 77.72,5.03 76.96,4.27 76.96,3.89 IC1.30 | v59.28,11.89 58.67,12.5 58.22,12.5 v56.92,11.2
  Bottom 0.152: v31.32,1.98 31.85,1.98 36.8,6.93 38.94,6.93 39.17,7.16 39.17,8.46 37.41,10.21 JP3.2 37.34,10.29 35.66,11.96 35.66,13.41 35.81,13.56 53.72,13.56 56.08,11.2 v56.92,11.2 | v75.82,7.47 74.6,7.47 70.18,11.89 v59.28,11.89
SCK  (via drill 0.33)
  Top 0.152: 78.68,14.21 78.79,14.33 78.79,15.54 78.71,15.62 74.22,15.62 74.07,15.47 72.16,15.47 71.17,16.46 ISP.3 | 78.68,14.21 78.1,13.64 78.1,12.8 IC1.17 | v96.47,8 93.38,11.09 | 93.38,11.09 92.81,11.66 92.81,12.27 U$1.CLK | v78.87,14.02 78.68,14.21 | 93.38,11.09 v93.19,10.9
  Bottom 0.152: v96.47,8 102.49,8 103.48,8.99 JP5.8 | v78.87,14.02 80.77,14.02 81.08,14.33 89.76,14.33 v93.19,10.9
SCL  (via drill 0.33)
  Top 0.152: v63.7,16.69 65.3,16.69 RTC-DS3231.16 | R9.1 51.82,15.54 52.81,15.54 v53.49,16.23 53.49,16.15 53.87,16.15 54.03,16 56.39,16 v58.06,14.33 | v81,1.07 78.41,1.07 75.44,4.04 75.44,4.27 75.74,4.57 75.74,4.95 IC1.28 | v57.45,2.29 59.59,2.29 IC5.6 59.66,2.36 60.12,2.36 60.96,3.2 60.96,4.04 60.81,4.19 58.52,4.19 58.22,4.5 58.22,5.26 58.45,5.49 v58.45,11.89
  Bottom 0.152: v53.49,16.23 63.25,16.23 v63.7,16.69 | JP5.11 100.89,3.89 97.46,0.46 81.61,0.46 v81,1.07 81.61,1.68 81.69,1.68 83.13,3.12 83.13,3.58 82.75,3.96 80.7,3.96 80.31,3.58 74.07,3.58 71.55,1.07 57.84,1.07 57.45,1.45 v57.45,2.29 | v58.06,14.33 58.06,12.27 v58.45,11.89
SDA  (via drill 0.33)
  Top 0.152: R10.1 51.74,17.07 53.8,17.07 54.03,17.3 62.26,17.3 64.16,15.39 65.3,15.39 RTC-DS3231.15 65.38,15.32 65.68,15.01 68.88,15.01 69.57,14.33 69.57,14.02 v71.32,12.27 | 73.38,4.95 72.31,4.95 71.93,5.33 71.93,7.92 72.31,8.31 v72.31,10.59 | 73.38,4.95 74.22,4.95 74.75,5.49 75.13,5.49 IC1.27 | v58.06,1.68 58.6,1.14 59.59,1.14 IC5.5 | v72.09,2.74 73.38,4.04 73.38,4.95
  Bottom 0.152: v71.32,12.27 72.31,11.28 v72.31,10.59 73.99,8.91 79.25,8.91 79.63,9.3 79.63,9.6 80.54,10.52 81,10.52 82.45,9.07 91.14,9.07 93.73,6.48 100.89,6.48 JP5.9 | v58.06,1.68 59.51,1.68 59.82,1.37 70.71,1.37 v72.09,2.74
SLD  (via drill 0.33)  (4 unrouted)
  Top 0.152: J2.S3 12.57,5.41 12.57,4.72 14.48,2.82 J2.S5 | v20.27,5.41 18.97,5.41 J2.S4 | v15.09,4.27 14.1,3.28 J2.S5 | J2.S6 16.92,2.82 14.55,2.82 J2.S5
  Bottom 0.152: v20.27,5.41 16.23,5.41 v15.09,4.27
TXD  (via drill 0.33)
  Top 0.152: v30.48,1.14 30.48,1.98 31.7,3.2 32.38,3.2 IC3.3 | v78.18,4.19 77.5,3.5 77.5,3.28 IC1.31
  Bottom 0.152: v30.48,1.14 31.09,0.53 34.37,0.53 38.25,4.42 39.55,4.42 40.96,5.83 | 40.96,5.83 41,5.87 41,11.51 39.7,12.8 37.41,12.8 JP3.1 | v78.18,4.19 73.99,4.19 73.15,3.35 71.78,3.35 70.1,1.68 59.97,1.68 57.99,3.66 43.13,3.66 40.96,5.83
VBAT  (via drill 0.33)  (2 unrouted)
  Top 0.152: 34.29,16.92 33.45,16.08 25.83,16.08 24.99,16.92 24,16.92 U1.3 23.93,16.92 23.62,16.92 v22.86,16.15 | v7.47,7.62 7.47,5.71 CNL.1 | v19.58,13.41 19.58,14.71 v20.27,15.39 | v65.3,4.19 64.08,4.19 BATTPOWER.2
  Bottom 0.152: v7.47,7.62 12.34,12.5 18.67,12.5 v19.58,13.41 | v20.27,15.39 22.1,15.39 v22.86,16.15 22.86,16.08 24.46,16.08 25.53,15.01 54.48,15.01 v65.3,4.19 65.68,4.19 67.74,6.25 69.65,6.25 69.95,6.55 77.95,6.55 80.01,8.61 91.14,8.61 93.57,6.17 99.82,6.17 101.04,4.95 101.35,4.95 102.49,3.81 102.49,2.44 103.48,1.45 JP5.14
VBUS  (via drill 0.33)  (4 unrouted)
  Top 0.152: 16.73,16.34 16.99,16.08 19.66,16.08 20.5,16.92 21.34,16.92 U1.4 21.41,16.99 v22.48,16.99 | 16.73,16.34 16.23,16.84 15.93,16.84 R1.2 | 18.06,10.59 18.06,11.35 17.75,11.66 IC6.2 | 18.06,10.59 18.06,10.13 C4.1 18.06,10.59 | 14.86,10.59 14.86,11.35 14.17,12.04 12.34,12.04 11.05,13.34 C1.2 | 14.86,10.59 12.12,7.85 11.66,7.85 | v19.2,10.59 18.06,10.59 | 14.86,10.59 v15.09,10.59 | L1.2 9.75,9.83 11.66,7.92 | v16.23,15.85 16.73,16.34
  Bottom 0.152: v15.09,10.59 v19.2,10.59 20.19,11.58 20.19,13.64 17.98,15.85 v16.23,15.85 | v22.48,16.99 24,16.99 25.68,15.32 71.17,15.32 72.54,13.95 73.61,13.95 ISP.2
VCC  (via drill 0.33)
  Top 0.152: IC1.4 81.91,4.34 82.3,4.34 82.6,4.04 82.75,4.04 83.29,4.57 83.29,5.18 82.98,5.49 IC1.6 82.91,5.56 82.91,6.02 v82.37,6.55 | SDPWER.2 78.1,14.94 78.1,14.1 77.11,13.11 77.11,12.5 77.42,12.19 IC1.18 77.5,12.12 77.5,11.89 81.53,7.85 | 81.53,7.85 83.97,7.85 85.04,8.91 85.04,10.29 84.96,10.36 84.96,14.86 REMOTE.2 | 81.53,7.85 v81.53,7.39 | 44.96,1.22 48.31,1.22 49.57,2.48 | 49.57,2.48 49.61,2.52 50.22,2.52 R3.2 | v35.43,0.76 35.2,0.99 34.21,0.99 IC4.3 | 44.96,1.22 v44.04,2.13 | 44.96,1.22 C14.1 | R10.2 50.06,16.99 50.06,15.54 R9.2 50.14,15.54 50.29,15.54 51.13,14.71 53.49,14.71 | 53.49,14.71 53.95,14.71 54.56,15.32 55.17,15.32 RTC-DS3231.2 | v67.36,2.59 67.97,1.98 67.97,1.37 C11.2 | v61.26,4.8 59.74,4.8 59.66,4.88 IC5.8 59.59,4.88 | v53.49,14.4 53.49,14.71 | v49.38,4.27 49.53,4.12 49.53,2.52 49.57,2.48
  Bottom 0.152: v82.37,6.55 v81.53,7.39 81.53,7.32 80.85,7.32 78.33,4.8 77.5,4.8 77.19,4.5 73.84,4.5 73,3.66 71.93,3.66 71.4,4.19 68.96,4.19 v67.36,2.59 66.98,2.59 66.83,2.44 63.63,2.44 v61.26,4.8 61.26,7.7 57.8,11.16 | v35.43,0.76 42.67,0.76 v44.04,2.13 | v53.49,14.4 54.56,14.4 57.8,11.16 | v49.38,4.27 50.9,4.27 57.8,11.16
VDD  (3 unrouted)
VGEN1  (via drill 0.33)  (2 unrouted)
  Top 0.152: 22.33,1.98 23.62,3.28 v23.7,3.28 | v8.46,15.32 7.47,14.33 CN2.1 | v22.56,0.99 24.46,0.99
  Bottom 0.152: v23.7,3.28 23.7,7.62 24.23,8.15 24.23,11.28 20.73,14.78 20.04,14.78 19.28,15.54 19.28,16.92 18.9,17.3 10.44,17.3 v8.46,15.32 | v22.56,0.99 22.33,0.99 19.43,3.89 15.54,3.89 15.32,3.66 12.95,3.66 9.6,7.01 7.24,7.01 6.86,7.39 6.86,7.85 12.5,13.49 13.03,13.49 JP1.1

### Text on the board
tPlace: ON | RIFFLE | IC2 | + | v0.1.4 | - | OFF | GND | VBUS | publiclab.org/riffle
bPlace: General | Riffle Beta 0.1.0 | TXD | RXD | publiclab.org/wiki/riffle | 3.7-6V | GND | CERN OHL v1.2 | Lithium | D5/RTC | 3.7V